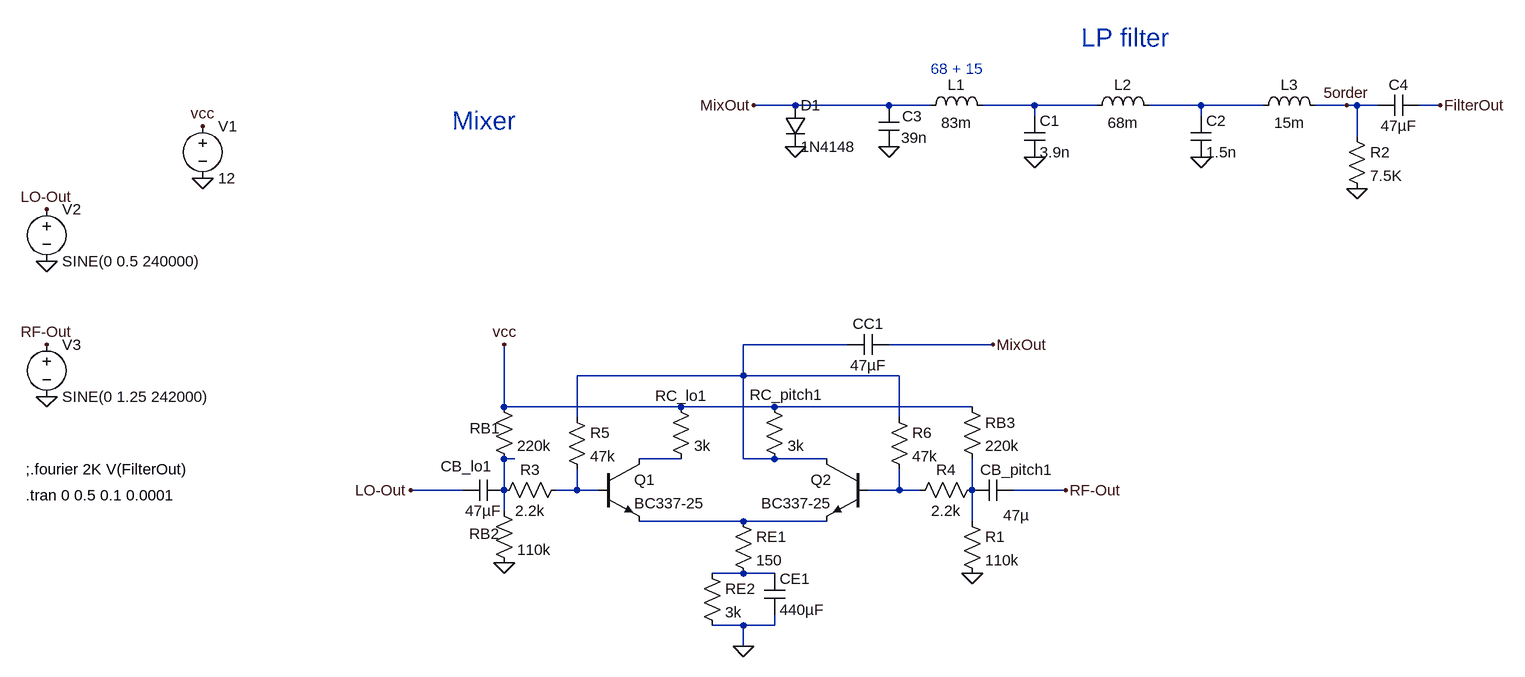
[diagram p0: schematic fuckAround.asc]
fuckAround.asc, the LTspice schematic file:
Version 4
SHEET 1 1976 680
WIRE 864 -240 800 -240
WIRE 1008 -240 864 -240
WIRE 1072 -240 1008 -240
WIRE 1232 -240 1152 -240
WIRE 1328 -240 1232 -240
WIRE 1488 -240 1408 -240
WIRE 1584 -240 1488 -240
WIRE 1712 -240 1664 -240
WIRE 1728 -240 1712 -240
WIRE 1760 -240 1728 -240
WIRE 1856 -240 1824 -240
WIRE 1232 -224 1232 -240
WIRE 1488 -224 1488 -240
WIRE 1728 -192 1728 -240
WIRE 944 128 784 128
WIRE 1168 128 1008 128
WIRE 784 176 784 128
WIRE 784 176 528 176
WIRE 1024 176 784 176
WIRE 416 224 416 128
WIRE 688 224 416 224
WIRE 832 224 688 224
WIRE 1136 224 832 224
WIRE 528 240 528 176
WIRE 1024 240 1024 176
WIRE 432 304 416 304
WIRE 688 304 624 304
WIRE 784 304 784 176
WIRE 832 304 784 304
WIRE 912 304 832 304
WIRE 352 352 272 352
WIRE 416 352 416 304
WIRE 528 352 528 320
WIRE 528 352 496 352
WIRE 560 352 528 352
WIRE 1024 352 1024 320
WIRE 1024 352 976 352
WIRE 1056 352 1024 352
WIRE 1136 352 1136 304
WIRE 1280 352 1200 352
WIRE 416 384 416 352
WIRE 784 400 624 400
WIRE 912 400 784 400
WIRE 1136 400 1136 352
WIRE 784 480 736 480
WIRE 832 480 784 480
WIRE 784 560 736 560
WIRE 832 560 832 544
WIRE 832 560 784 560
WIRE 784 592 784 560
FLAG 784 592 0
FLAG 416 464 0
FLAG 1136 480 0
FLAG 1168 128 MixOut
FLAG 272 352 LO-Out
FLAG 1280 352 RF-Out
FLAG -288 0 0
FLAG -288 208 0
FLAG -48 -128 0
FLAG -288 -80 LO-Out
FLAG -288 128 RF-Out
FLAG -48 -208 vcc
FLAG 416 128 vcc
FLAG 1856 -240 FilterOut
FLAG 1488 -160 0
FLAG 1232 -160 0
FLAG 1728 -112 0
FLAG 1712 -240 5order
FLAG 864 -176 0
FLAG 1008 -176 0
FLAG 800 -240 MixOut
SYMBOL npn 560 304 R0
SYMATTR InstName Q1
SYMATTR Value BC337-25
SYMBOL npn 976 304 M0
SYMATTR InstName Q2
SYMATTR Value BC337-25
SYMBOL res 768 384 R0
SYMATTR InstName RE1
SYMATTR Value 150
SYMBOL res 720 464 R0
SYMATTR InstName RE2
SYMATTR Value 3k
SYMBOL cap 816 480 R0
SYMATTR InstName CE1
SYMATTR Value 440µF
SYMBOL res 400 208 R0
WINDOW 0 -37 49 Left 2
SYMATTR InstName RB1
SYMATTR Value 220k
SYMBOL res 400 368 R0
WINDOW 0 -38 51 Left 2
SYMATTR InstName RB2
SYMATTR Value 110k
SYMBOL res 1120 384 R0
SYMATTR InstName R1
SYMATTR Value 110k
SYMBOL res 1120 208 R0
SYMATTR InstName RB3
SYMATTR Value 220k
SYMBOL cap 416 336 R90
WINDOW 0 -5 58 VBottom 2
WINDOW 3 32 32 VTop 2
SYMATTR InstName CB_lo1
SYMATTR Value 47µF
SYMBOL cap 1200 336 R90
WINDOW 0 0 -4 VBottom 2
WINDOW 3 39 -4 VTop 2
SYMATTR InstName CB_pitch1
SYMATTR Value 47µ
SYMBOL cap 1008 112 R90
WINDOW 0 0 32 VBottom 2
WINDOW 3 32 32 VTop 2
SYMATTR InstName CC1
SYMATTR Value 47µF
SYMBOL res 816 208 R0
WINDOW 0 -22 -3 Left 2
SYMATTR InstName RC_pitch1
SYMATTR Value 3k
SYMBOL res 672 208 R0
WINDOW 0 -24 -1 Left 2
SYMATTR InstName RC_lo1
SYMATTR Value 3k
SYMBOL voltage -48 -224 R0
WINDOW 123 0 0 Left 0
WINDOW 39 0 0 Left 0
SYMATTR InstName V1
SYMATTR Value 12
SYMBOL voltage -288 -96 R0
WINDOW 123 0 0 Left 0
WINDOW 39 0 0 Left 0
SYMATTR InstName V2
SYMATTR Value SINE(0 0.5 240000)
SYMBOL voltage -288 112 R0
WINDOW 123 0 0 Left 0
WINDOW 39 0 0 Left 0
SYMATTR InstName V3
SYMATTR Value SINE(0 1.25 242000)
SYMBOL ind 1056 -224 R270
WINDOW 0 32 56 VTop 2
WINDOW 3 5 56 VBottom 2
SYMATTR InstName L1
SYMATTR Value 83m
SYMBOL ind 1312 -224 R270
WINDOW 0 32 56 VTop 2
WINDOW 3 5 56 VBottom 2
SYMATTR InstName L2
SYMATTR Value 68m
SYMBOL cap 1216 -224 R0
SYMATTR InstName C1
SYMATTR Value 3.9n
SYMBOL cap 1472 -224 R0
SYMATTR InstName C2
SYMATTR Value 1.5n
SYMBOL ind 1568 -224 R270
WINDOW 0 32 56 VTop 2
WINDOW 3 5 56 VBottom 2
SYMATTR InstName L3
SYMATTR Value 15m
SYMBOL res 1712 -208 R0
SYMATTR InstName R2
SYMATTR Value 7.5K
SYMBOL cap 992 -240 R0
WINDOW 0 36 17 Left 2
WINDOW 3 35 50 Left 2
SYMATTR InstName C3
SYMATTR Value 39n
SYMBOL cap 1824 -256 R90
WINDOW 0 0 32 VBottom 2
WINDOW 3 32 32 VTop 2
SYMATTR InstName C4
SYMATTR Value 47µF
SYMBOL res 512 336 R90
WINDOW 0 0 56 VBottom 2
WINDOW 3 32 56 VTop 2
SYMATTR InstName R3
SYMATTR Value 2.2k
SYMBOL res 1152 336 R90
WINDOW 0 0 56 VBottom 2
WINDOW 3 32 56 VTop 2
SYMATTR InstName R4
SYMATTR Value 2.2k
SYMBOL res 512 224 R0
SYMATTR InstName R5
SYMATTR Value 47k
SYMBOL res 1008 224 R0
SYMATTR InstName R6
SYMATTR Value 47k
SYMBOL diode 848 -240 R0
SYMATTR InstName D1
SYMATTR Value 1N4148
TEXT 336 -216 Left 4 ;Mixer
TEXT -320 360 Left 2 !.tran 0 0.5 0.1 0.0001
TEXT -320 320 Left 2 !;.fourier 2K V(FilterOut)
TEXT 1304 -344 Left 4 ;LP filter
TEXT 1072 -296 Left 2 ;68 + 15

The netlist it stands for:
* fuckAround.asc
Q1 N005 N006 N009 0 BC337-25
Q2 N003 N007 N009 0 BC337-25
RE1 N009 N010 150
RE2 N010 0 3k
CE1 N010 0 440µF
RB1 vcc N004 220k
RB2 N004 0 110k
R1 N008 0 110k
RB3 vcc N008 220k
CB_lo1 N004 LO-Out 47µF
CB_pitch1 RF-Out N008 47µ
CC1 MixOut N003 47µF
RC_pitch1 vcc N003 3k
RC_lo1 vcc N005 3k
V1 vcc 0 12
V2 LO-Out 0 SINE(0 0.5 240000)
V3 RF-Out 0 SINE(0 1.25 242000)
L1 MixOut N001 83m
L2 N001 N002 68m
C1 N001 0 3.9n
C2 N002 0 1.5n
L3 N002 5order 15m
R2 5order 0 7.5K
C3 MixOut 0 39n
C4 FilterOut 5order 47µF
R3 N006 N004 2.2k
R4 N008 N007 2.2k
R5 N003 N006 47k
R6 N003 N007 47k
D1 MixOut 0 1N4148
.model D D
.lib standard.dio
.model NPN NPN
.model PNP PNP
.lib standard.bjt
* Mixer
.tran 0 0.5 0.1 0.0001
;.fourier 2K V(FilterOut)
* LP filter
* 68 + 15
.backanno
.end